# Altium schematic sheet Temperature sensing and heater power.SchDoc
size A
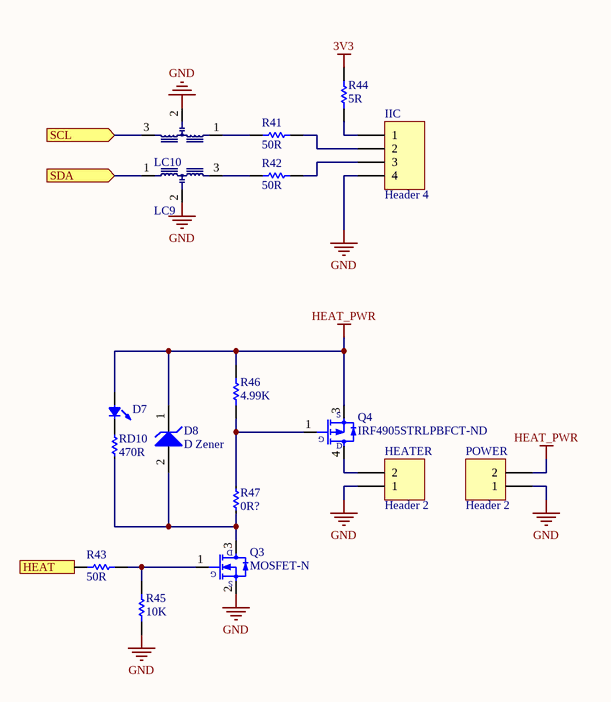
[diagram p0: Temperature sensing and heater power.SchDoc]

## Parts
D7  LED0  [T1 LED]  (value not drawn)
D8  D Zener  [SOD123/X.85]
HEATER  Header 2  [Molex Mini-Fit Jr 5569 - 2 Pin, RA]
IIC  Header 4  [AMPModu MTE 4 Pin Shrouded Header]
LC9  MEM2012F  [MEM2012S LC Filter]  (value not drawn)
LC10  MEM2012F  [MEM2012S LC Filter]  (value not drawn)
POWER  Header 2  [Molex Mini-Fit Jr 5569 - 2 Pin, RA]
Q3  MOSFET-N  [SOT23-3N]
Q4  IRF4905STRLPBFCT-ND  [TO254P1520-3_4N]
R41  value 50R  [0603R]  (hidden comment: Res Semi)
R42  value 50R  [0603R]  (hidden comment: Res Semi)
R43  value 50R  [0603R]  (hidden comment: Res Semi)
R44  value 5R  [1206R]  (hidden comment: Res Semi)
R45  value 10K  [0603R]  (hidden comment: Res Semi)
R46  value 4.99K  [1206R]  (hidden comment: Res Semi)
R47  value 0R?  [0603R]  (hidden comment: Res Semi Small)
RD10  value 470R  [0603R]  (hidden comment: Res Semi Small)

## Ports
HEAT (in), SCL (in), SDA (in)

## Nets
3V3: R44.2
GND: HEATER.1 IIC.4 LC9.2 LC10.2 POWER.1 Q3.2(S) R45.1
HEAT_PWR: D7.1 D8.1(A) POWER.2 Q4.3(D) R46.2
HEAT: R43.1 ; port HEAT
SCL: LC10.3 ; port SCL
SDA: LC9.1 ; port SDA
NetD7_2: D7.2 RD10.1
NetD8_2: D8.2(K) Q3.3(D) R47.2 RD10.2
NetHEATER_2: HEATER.2 Q4.4(S)
NetIIC_1: IIC.1 R44.1
NetIIC_2: IIC.2 R41.2
NetIIC_3: IIC.3 R42.2
NetLC9_3: LC9.3 R42.1
NetLC10_1: LC10.1 R41.1
NetQ3_1: Q3.1(G) R43.2 R45.2
NetQ4_1: Q4.1(G) R46.1 R47.1

## Library data of the parts
D7 = LED0: T 1 3/4 LED; Published: 8-Jun-2000; LatestRevisionDate: 08-Jul-2005; LatestRevisionNote: Mech Layer 1 removed.; PackageReference: LED-0; Publisher: Altium Limited
D8 = D Zener: Zener Diode; Published: 8-Jun-2000; LatestRevisionDate: 17-Jul-2002; LatestRevisionNote: Re-released for DXP Platform.; PackageReference: DIODE-0.7; Publisher: Altium Limited
HEATER POWER = Header 2: Header, 2-Pin; LatestRevisionDate: 17-Jul-2002; LatestRevisionNote: Re-released for DXP Platform.; Publisher: Altium Limited
IIC = Header 4: Header, 4-Pin; LatestRevisionDate: 17-Jul-2002; LatestRevisionNote: Re-released for DXP Platform.; Publisher: Altium Limited
LC9 LC10 = MEM2012F - Signal Filter: Signal Line 3-terminal Filters
Q3 = MOSFET-N: N-Channel MOSFET; Published: 8-Jun-2000; LatestRevisionDate: 17-Jul-2002; LatestRevisionNote: Re-released for DXP Platform.; PackageVersion: 1995/1996; PackageReference: E3; Publisher: Altium Limited
Q4 = MOSFET-P: P-Channel MOSFET; Published: 8-Jun-2000; LatestRevisionDate: 17-Jul-2002; LatestRevisionNote: Re-released for DXP Platform.; PackageVersion: 1995/1996; PackageReference: E3; Publisher: Altium Limited
R41-R46 = Res Semi: Semiconductor Resistor; Published: 8-Jun-2000; LatestRevisionDate: 17-Jul-2002; LatestRevisionNote: Re-released for DXP Platform.; PackageReference: AXIAL-0.5; Publisher: Altium Limited
R47 RD10 = Res Semi Small: Semiconductor Resistor; Published: 8-Jun-2000; LatestRevisionDate: 17-Jul-2002; LatestRevisionNote: Re-released for DXP Platform.; PackageReference: AXIAL-0.5; Publisher: Altium Limited